# Altium schematic sheet Optical_Fiber.SchDoc
size A4; SheetNumber: 4; SheetTotal: 4
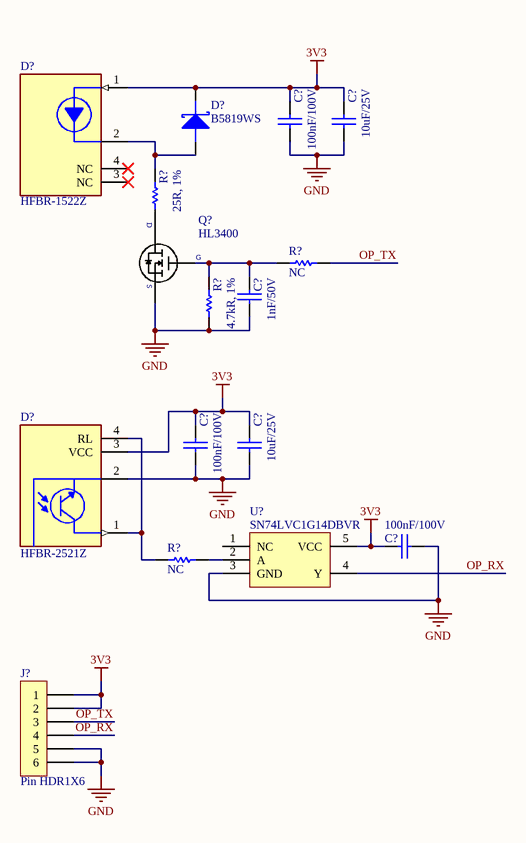
[diagram p0: Optical_Fiber.SchDoc]

## Parts
(Parts that share a designator on the sheet are numbered #1, #2 ... from top to bottom, then left to right.)
C?#1  100nF/100V  [0603C]
C?#2  10uF/25V  [0603C]
C?#3  1nF/50V  [0603C]
C?#4  100nF/100V  [0603C]
C?#5  10uF/25V  [0603C]
C?#6  100nF/100V  [0603C]
D?#1  HFBR-1522Z  [HFBR_1521Z]
D?#2  B5819WS  [SOD-123]
D?#3  HFBR-2521Z  [HFBR_2521Z]
J?  Pin HDR1X6  [Pin HDR1X6/2.54mm-W]
Q?  HL3400  [SOT23-3]
R?#1  25R, 1%  [0603R]
R?#2  NC  [0603R]
R?#3  4.7kR, 1%  [0603R]
R?#4  NC  [0603R]
U?  SN74LVC1G14DBVR  [SOT23-5]

## Nets
3V3: C?#1.1 C?#2.1 C?#4.1 C?#5.1 C?#6.1 D?#1.1(VO) D?#2.K D?#3.3(VCC) J?.1 J?.2 U?.5(VCC)
GND: C?#1.2 C?#2.2 C?#3.1 C?#4.2 C?#5.2 C?#6.2 D?#3.2(GROUND) J?.5 J?.6 Q?.2 R?#3.1 U?.3(GND)
OP_RX: J?.4 U?.4(Y)
OP_TX: J?.3 R?#2.1
NetC?#3_2: C?#3.2 Q?.1 R?#2.2 R?#3.2
NetD?#1_2: D?#1.2(GROUND) D?#2.A R?#1.1
NetD?#3_1: D?#3.1(VO) D?#3.4(RL) R?#4.2
NetQ?_3: Q?.3 R?#1.2
NetR?#4_1: R?#4.1 U?.2(A)

Not connected (* = marked no-connect by the designer): D?#1 3(NC)* 4(NC)*; U? 1(NC)

## Notes on the sheet
- (in symbol NMOS) D; G; S

## Library data of the parts
C?#1 C?#4 C?#6 = CAP: CC0603KRX7R9BB104
C?#2 C?#5 = CAP: CC0603MRX5R8BB106
C?#3 = CAP: CC0603KRX7R9BB102
D?#1 = HFBR-1521Z: Versatile Link Fiber-Optic Connection; MF: Broadcom Limited; MP: HFBR-2521Z; SnapEDA_Link: https://www.snapeda.com/parts/HFBR-2521Z/Broadcom/view-part/?ref=snap; Package: None; Value: *; Check_prices: https://www.snapeda.com/parts/HFBR-2521Z/Broadcom/view-part/?ref=eda
D?#2 = DIODE SCHOTTKY
D?#3 = HFBR-2521Z: Versatile Link Fiber-Optic Connection; MF: Broadcom Limited; SnapEDA_Link: https://www.snapeda.com/parts/HFBR-2521Z/Broadcom/view-part/?ref=snap; Package: None; Value: *; MP: HFBR-2521Z; Check_prices: https://www.snapeda.com/parts/HFBR-2521Z/Broadcom/view-part/?ref=eda
Q? = NMOS
R?#1 = RES: RP0603BRD0725RL
R?#2 R?#4 = RES
R?#3 = RES: RC0603FR-074K7L
U? = SN74LVC1G14DBVR: Y=A\